# EAGLE schematic CICERONE AirLink (EAGLE 9.7.0)
COMPANY: https://github.com/atari-researchlab/cicerone-airlink; COPYRIGHT: Copyright (C) 2025 ATARI Research Lab; LICENSE: CERN-OHL-S-2.0+; PROJECT_NAME: CICERONE Airlink
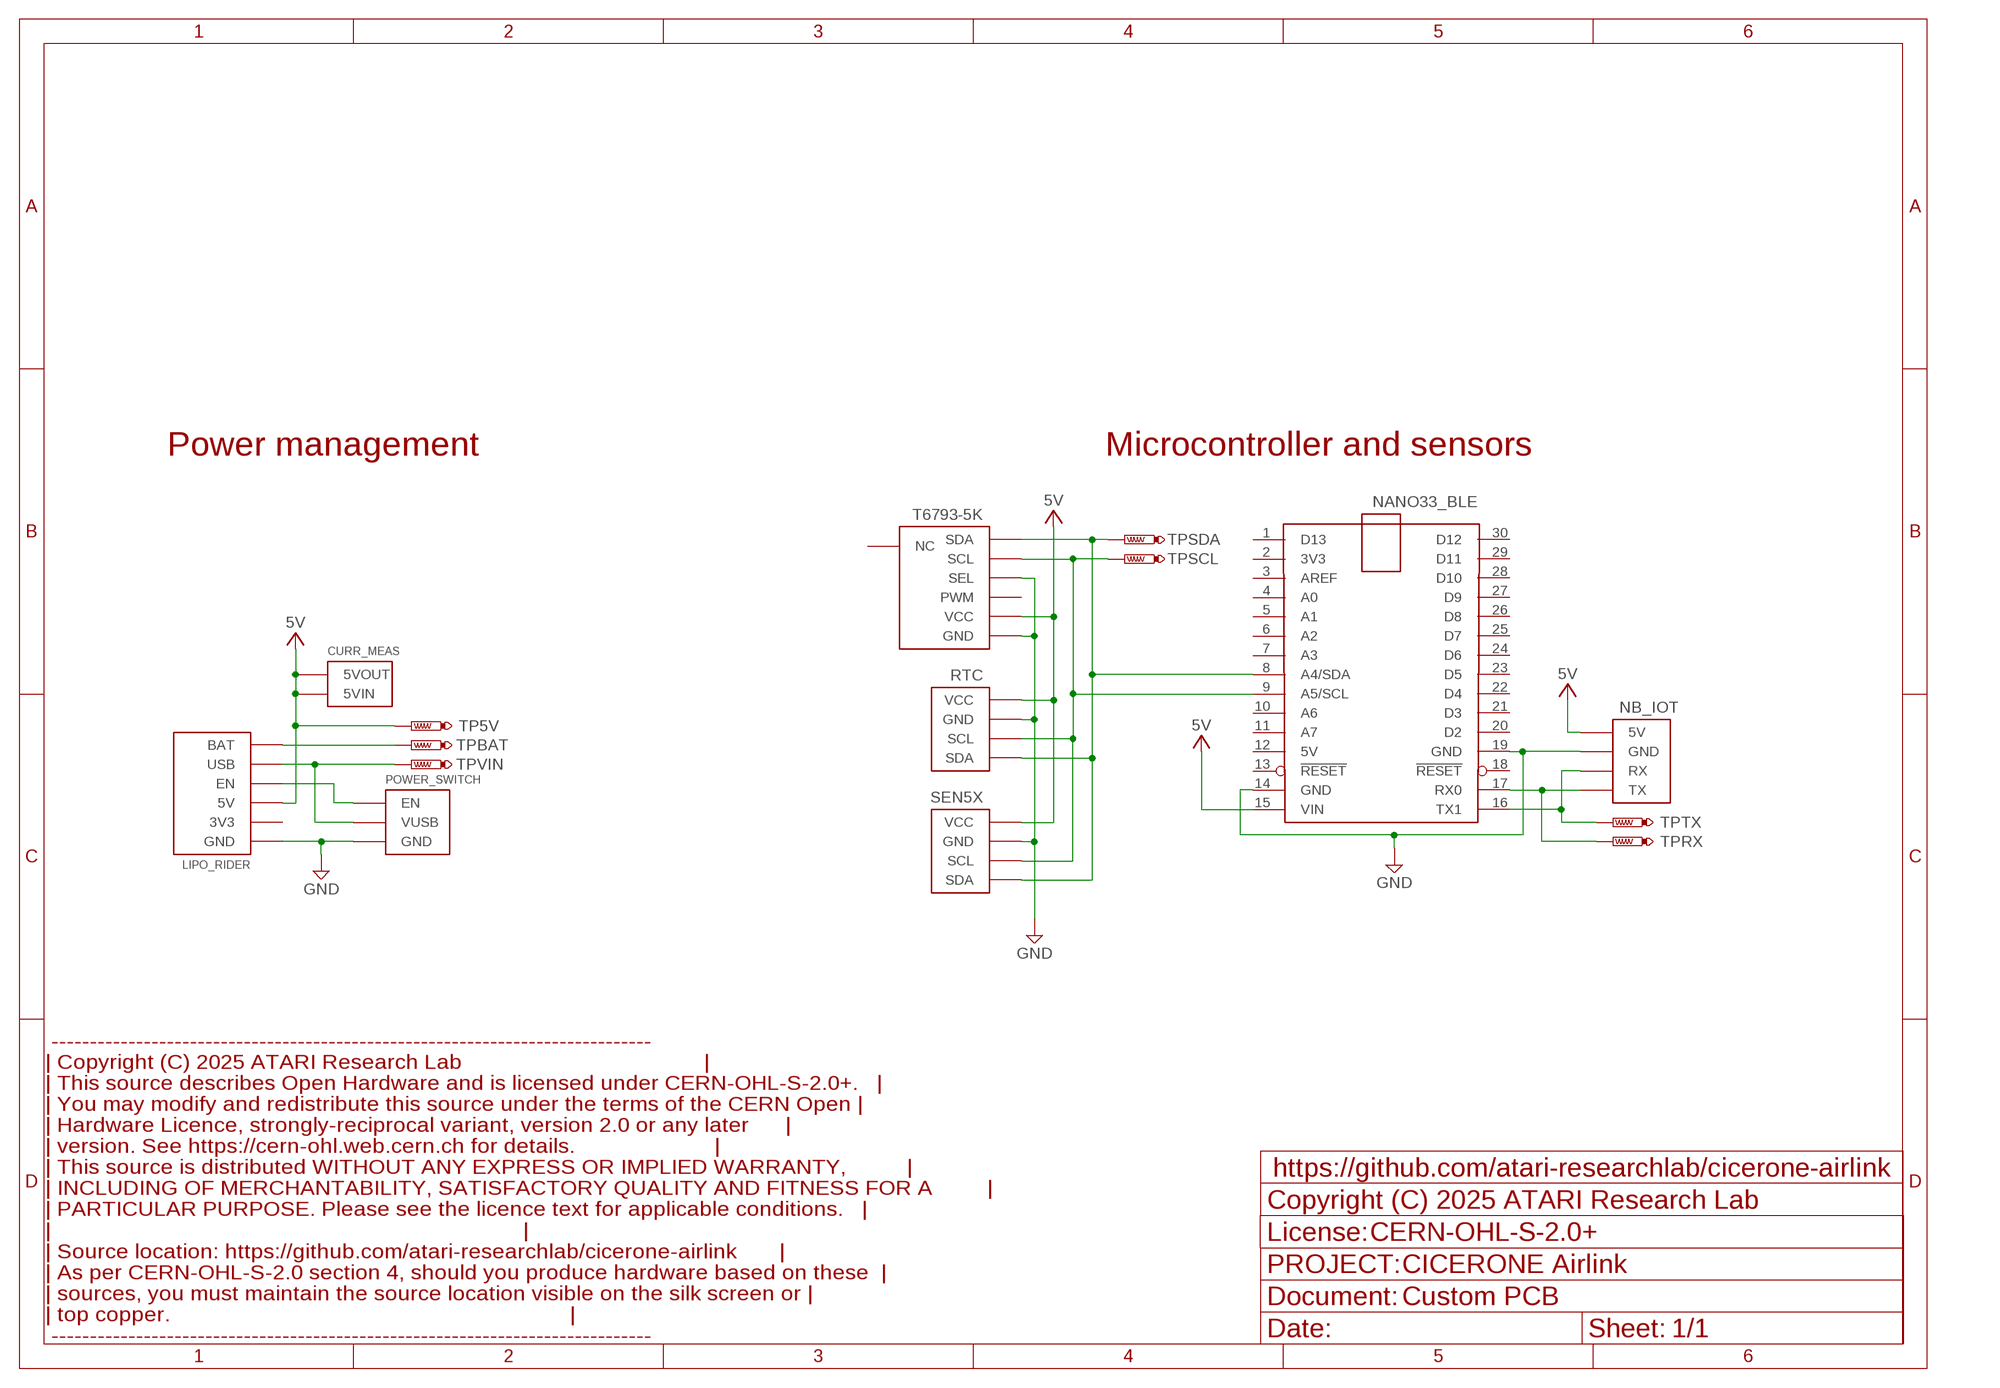
[diagram p0: schematic, sheet 1]

## Parts
CURR_MEAS  I→  CURR-MEAS  [PIN2X1]
LIPO_RIDER  LIPO-RIDER  [LIPO-RIDER-STAND]
NANO33_BLE  NANO33_BLEPIN  [NANO_BLE33_PIN]
NB_IOT  GROVE-UARTSMD  [GROVE_SMD]
POWER_SWITCH  USB_SWITCH  [USB-SWITCH]
RTC  MODULO_RTC  RTC-DS3231MMOD-90  [DS3231M-MOD-90]
SEN5X  I2C-HEADER  [I2C-HEADER]
T6793-5K  T6793  [T6793]
TP5V  PTR1TP20SQ  [TP20SQ]
TPBAT  PTR1TP20SQ  [TP20SQ]
TPRX  PTR1TP20SQ  [TP20SQ]
TPSCL  PTR1TP20SQ  [TP20SQ]
TPSDA  PTR1TP20SQ  [TP20SQ]
TPTX  PTR1TP20SQ  [TP20SQ]
TPVIN  PTR1TP20SQ  [TP20SQ]

## Nets
5V [PWR]: CURR_MEAS.P$1(5VOUT) CURR_MEAS.P$2(5VIN) LIPO_RIDER.P$4(5V) NANO33_BLE.15(VIN) NB_IOT.ROJ(5V) RTC.P$1(VCC) SEN5X.VCC T6793-5K.P$3(VCC) TP5V.TP
EN: LIPO_RIDER.P$2(EN) POWER_SWITCH.P$4(EN)
GND [GND]: LIPO_RIDER.P$3(GND) LIPO_RIDER.P$5(GND) LIPO_RIDER.P$7(GND) NANO33_BLE.14(GND) NANO33_BLE.19(GND) NB_IOT.NEG(GND) NB_IOT.P$1(GND) NB_IOT.P$2(GND) POWER_SWITCH.P$1(GND) RTC.P$2(GND) SEN5X.GND T6793-5K.P$4(GND) T6793-5K.P$6(SEL)
RX_ARDU: NANO33_BLE.17(RX0) NB_IOT.BLA(TX) TPRX.TP
SCL: NANO33_BLE.9(A5/SCL) RTC.P$3(SCL) SEN5X.SCL T6793-5K.P$2(SCL) TPSCL.TP
SDA: NANO33_BLE.8(A4/SDA) RTC.P$4(SDA) SEN5X.SDA T6793-5K.P$1(SDA) TPSDA.TP
TX_ARDU: NANO33_BLE.16(TX1) NB_IOT.AMA(RX) TPTX.TP
VBAT: LIPO_RIDER.P$6(BAT) TPBAT.TP
VUSB [PWR]: LIPO_RIDER.P$8(USB) POWER_SWITCH.P$2(VUSB) POWER_SWITCH.P$3(VUSB) TPVIN.TP
Unconnected: LIPO_RIDER.P$1(3V3) NANO33_BLE.1(D13) NANO33_BLE.2(3V3) NANO33_BLE.3(AREF) NANO33_BLE.4(A0) NANO33_BLE.5(A1) NANO33_BLE.6(A2) NANO33_BLE.7(A3) NANO33_BLE.10(A6) NANO33_BLE.11(A7) NANO33_BLE.12(5V) NANO33_BLE.13(!RESET) NANO33_BLE.18(!RESET) NANO33_BLE.20(D2) NANO33_BLE.21(D3) NANO33_BLE.22(D4) NANO33_BLE.23(D5) NANO33_BLE.24(D6) NANO33_BLE.25(D7) NANO33_BLE.26(D8) NANO33_BLE.27(D9) NANO33_BLE.28(D10) NANO33_BLE.29(D11) NANO33_BLE.30(D12) T6793-5K.P$5(PWM) T6793-5K.P$7(NC)

## Notes on the sheet
- Power management | Microcontroller and sensors
- ------------------------------------------------------------------------------
  | Copyright (C) 2025 ATARI Research Lab                                        |
  | This source describes Open Hardware and is licensed under CERN-OHL-S-2.0+.   |
  | You may modify and redistribute this source under the terms of the CERN Open |
  | Hardware Licence, strongly-reciprocal variant, version 2.0 or any later      |
  | version. See https://cern-ohl.web.cern.ch for details.                       |
  | This source is distributed WITHOUT ANY EXPRESS OR IMPLIED WARRANTY,          |
  | INCLUDING OF MERCHANTABILITY, SATISFACTORY QUALITY AND FITNESS FOR A         |
  | PARTICULAR PURPOSE. Please see the licence text for applicable conditions.   |
  |                                                                              |
  | Source location: https://github.com/atari-researchlab/cicerone-airlink       |
  | As per CERN-OHL-S-2.0 section 4, should you produce hardware based on these  |
  | sources, you must maintain the source location visible on the silk screen or |
  | top copper.                                                                  |
   ------------------------------------------------------------------------------

## Library data of the parts
CURR_MEAS = Custom Cicerone:CURR-MEAS
LIPO_RIDER = Custom Cicerone:LIPO-RIDER
NANO33_BLE = ArduinoNano:NANO33_BLE: Arduino Nano V3.0 Overview: The Arduino Nano is a small, complete, and breadboard-friendly board based on the ATmega328 (Arduino Nano 3.x) or ATmega168 (Arduino Nano 2.x). It has more or less the same functionality of the Arduino Duemilanove, but in a different package. It lacks only a DC power jack, and works with a Mini-B USB cable instead of a standard one. The Nano was designed and is being produced by Gravitech. Specifications: Microcontroller Atmel ATmega168 or ATmega328 Operating Voltage (logic level) 5 V Input Voltage (recommended) 7-12 V Input Voltage (limits) 6-20 V Digital I/O Pins 14 (of which 6 provide PWM output) Analog Input Pins 8 DC Current per I/O Pin 40 mA Flash Memory 16 KB (ATmega168) or 32 KB (ATmega328) of which 2 KB used by bootloader SRAM 1 KB (ATmega168) or 2 KB (ATmega328) EEPROM 512 bytes (ATmega168) or 1 KB (ATmega328) Clock Speed 16 MHz Dimensions 0.73" x 1.70" Length 45 mm Width 18 mm Weigth 5 g Power: The Arduino Nano can be powered via the Mini-B USB connection, 6-20V unregulated external power supply (pin 30), or 5V regulated external power supply (pin 27). The power source is automatically selected to the highest voltage source. Memory: The ATmega168 has 16 KB of flash memory for storing code (of which 2 KB is used for the bootloader); the ATmega328 has 32 KB, (also with 2 KB used for the bootloader). The ATmega168 has 1 KB of SRAM and 512 bytes of EEPROM (which can be read and written with the EEPROM library); the ATmega328 has 2 KB of SRAM and 1 KB of EEPROM. Input and Output: Each of the 14 digital pins on the Nano can be used as an input or output, using pinMode(), digitalWrite(), and digitalRead() functions. They operate at 5 volts. Each pin can provide or receive a maximum of 40 mA and has an internal pull-up resistor (disconnected by default) of 20-50 kOhms. In addition, some pins have specialized functions. Visit Arduino - ArduinoBoardNano <https://www.arduino.cc/en/Main/ArduinoBoardNano>
NB_IOT = Custom Cicerone:GROVE-UART
POWER_SWITCH = Custom Cicerone:USB_SWITCH
RTC = Custom Cicerone:RTC-DS3231M
SEN5X = Custom Cicerone:I2C-HEADER
T6793-5K = Custom Cicerone:T6793
TP5V TPBAT TPRX TPSCL TPSDA TPTX TPVIN = testpad:PTR1: TEST PIN

## Net classes
0 default: width 1 mm
1 PWR: width 1.5 mm
2 GND: width 1 mm